# EAGLE design QuadPFets (EAGLE 7.4.0)
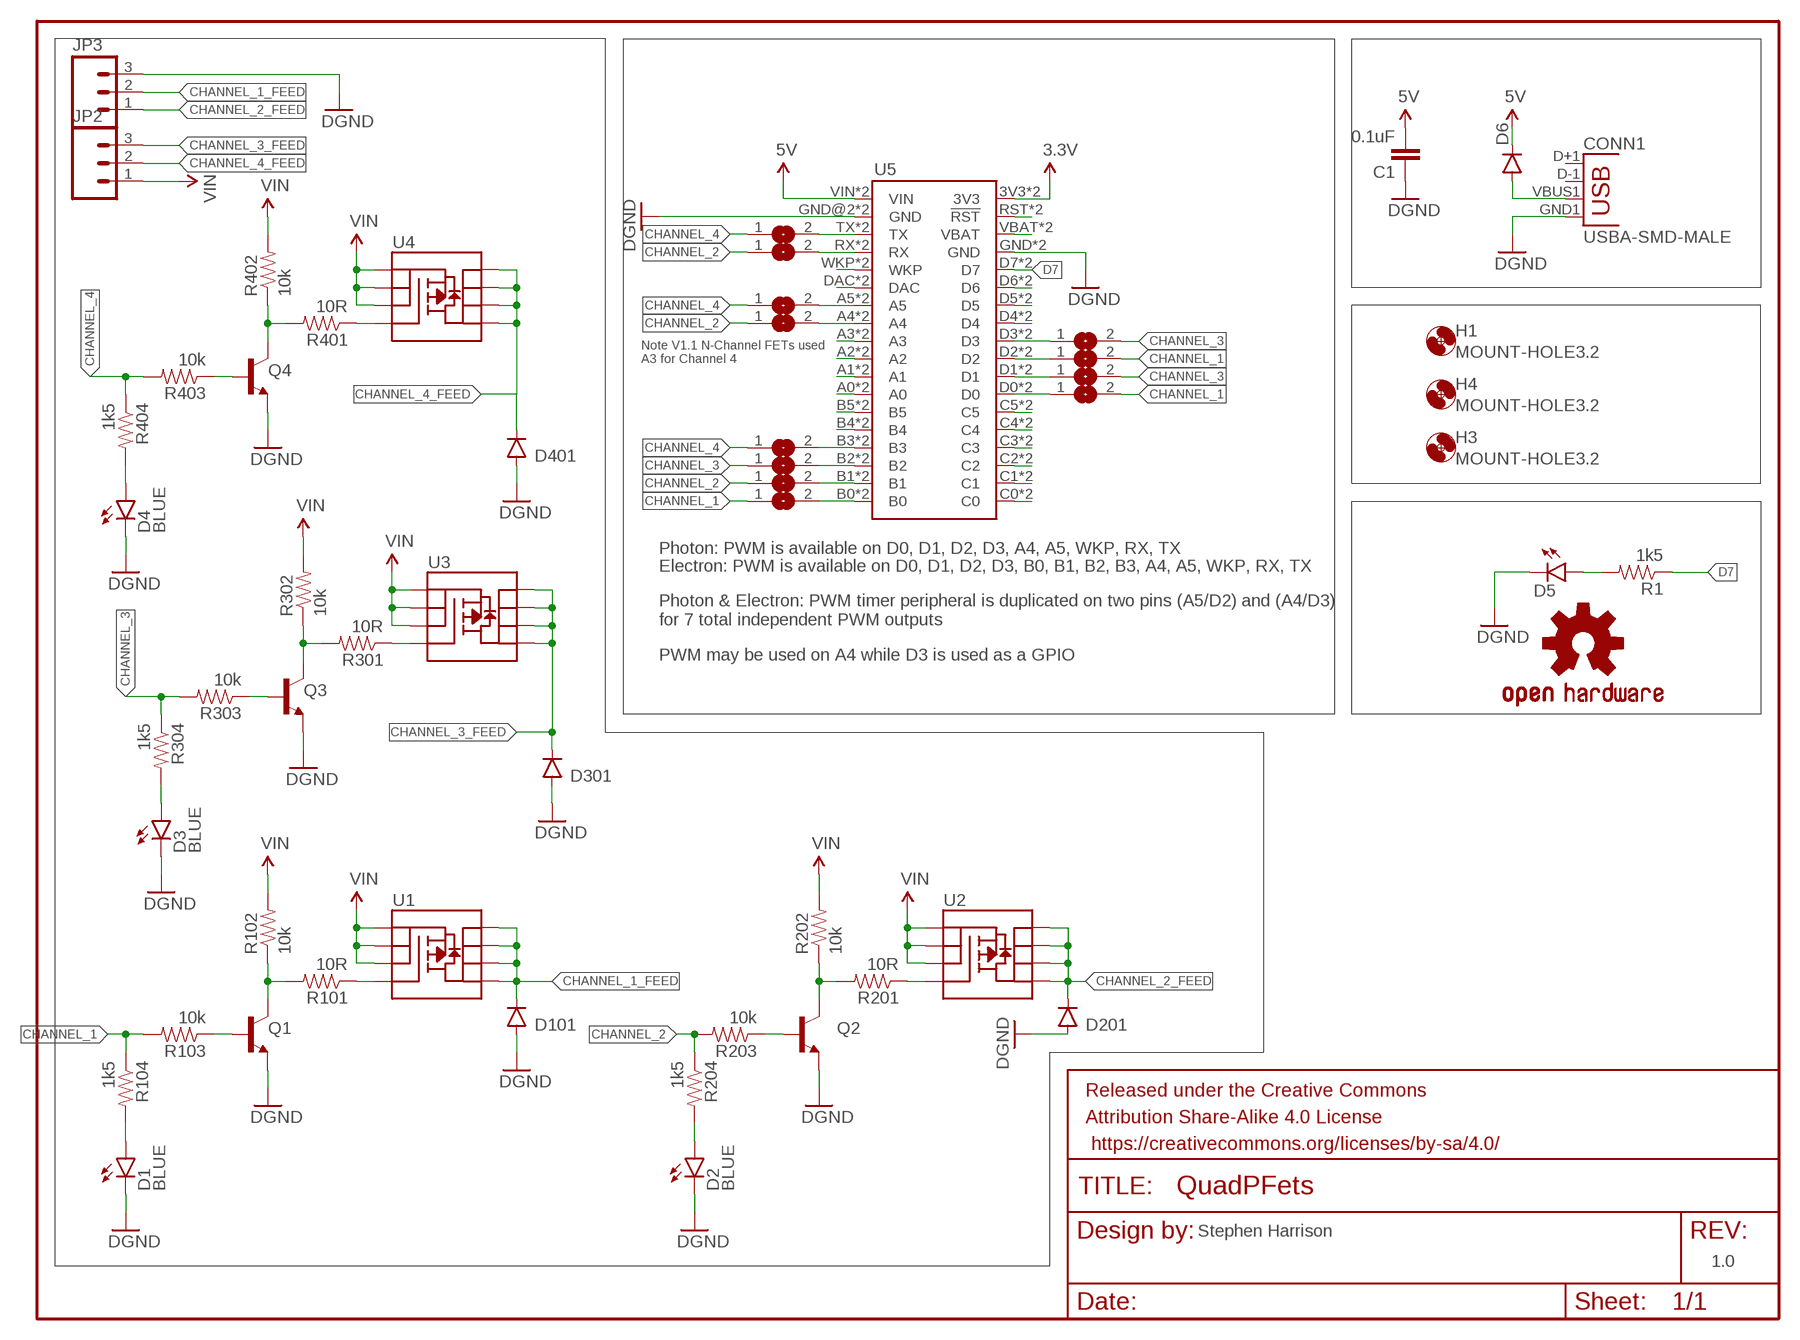
[diagram p0: schematic, sheet 1]

## Parts
C1  0.1uF  CAP0805  [0805]
CONN1  USBA-SMD-MALE  [USB-A-SMT-MALE]
D1  BLUE  LED-BLUE1206  [LED-1206]
D2  BLUE  LED-BLUE1206  [LED-1206]
D3  BLUE  LED-BLUE1206  [LED-1206]
D4  BLUE  LED-BLUE1206  [LED-1206]
D5  LED1206-BOTTOM  [LED-1206-BOTTOM]
D6  DIODESMA  [SMA-DIODE]
D101  DIODESOD123  [SOD-123]
D201  DIODESOD123  [SOD-123]
D301  DIODESOD123  [SOD-123]
D401  DIODESOD123  [SOD-123]
FRAME2  FRAME-LETTER  [CREATIVE_COMMONS]
H1  MOUNT-HOLE3.2  [3,2]
H3  MOUNT-HOLE3.2  [3,2]
H4  MOUNT-HOLE3.2  [3,2]
JP2  M03-SCREW-5MM  [SCREWTERMINAL-5MM-3]
JP3  M03-SCREW-5MM  [SCREWTERMINAL-5MM-3]
LOGO1  OSHW-LOGOM  [OSHW-LOGO-M]
Q1  BC817-40SMD  [SOT23-BEC]
Q2  BC817-40SMD  [SOT23-BEC]
Q3  BC817-40SMD  [SOT23-BEC]
Q4  BC817-40SMD  [SOT23-BEC]
R1  1k5  RESISTOR0805-RES  [0805]
R101  10R  RESISTOR0805-RES  [0805]
R102  10k  RESISTOR0805-RES  [0805]
R103  10k  RESISTOR0805-RES  [0805]
R104  1k5  RESISTOR0805-RES  [0805]
R201  10R  RESISTOR0805-RES  [0805]
R202  10k  RESISTOR0805-RES  [0805]
R203  10k  RESISTOR0805-RES  [0805]
R204  1k5  RESISTOR0805-RES  [0805]
R301  10R  RESISTOR0805-RES  [0805]
R302  10k  RESISTOR0805-RES  [0805]
R303  10k  RESISTOR0805-RES  [0805]
R304  1k5  RESISTOR0805-RES  [0805]
R401  10R  RESISTOR0805-RES  [0805]
R402  10k  RESISTOR0805-RES  [0805]
R403  10k  RESISTOR0805-RES  [0805]
R404  1k5  RESISTOR0805-RES  [0805]
SJ1  SJ  [SJ]
SJ2  SJ  [SJ]
SJ3  SJ  [SJ]
SJ4  SJ  [SJ]
SJ5  SJ  [SJ]
SJ6  SJ  [SJ]
SJ7  SJ  [SJ]
SJ8  SJ  [SJ]
SJ9  SJ  [SJ]
SJ10  SJ  [SJ]
SJ11  SJ  [SJ]
SJ12  SJ  [SJ]
U1  MOSFET-PCHANNEL-SOIC8SOIC8  [SO08]
U2  MOSFET-PCHANNEL-SOIC8SOIC8  [SO08]
U3  MOSFET-PCHANNEL-SOIC8SOIC8  [SO08]
U4  MOSFET-PCHANNEL-SOIC8SOIC8  [SO08]
U5  ELECTRONDUALNAMED  [ELECTRON_SIMPLE_SILK_NAMES_DUAL]

## Nets
3.3V: U5.3V3 U5.3V3_1(3V3)
5V: C1.2 D6.C U5.VIN U5.VIN_1B(VIN)
CHANNEL_1: R103.2 R104.1 SJ4.1 SJ5.2 SJ11.2
CHANNEL_1_FEED: D101.C JP3.2 U1.5(D) U1.6(D) U1.7(D) U1.8(D)
CHANNEL_2: R203.2 R204.1 SJ3.1 SJ8.1 SJ10.1
CHANNEL_2_FEED: D201.C JP3.1 U2.5(D) U2.6(D) U2.7(D) U2.8(D)
CHANNEL_3: R303.2 R304.1 SJ2.1 SJ6.2 SJ12.2
CHANNEL_3_FEED: D301.C JP2.3 U3.5(D) U3.6(D) U3.7(D) U3.8(D)
CHANNEL_4: R403.2 R404.1 SJ1.1 SJ7.1 SJ9.1
CHANNEL_4_FEED: D401.C JP2.2 U4.5(D) U4.6(D) U4.7(D) U4.8(D)
D7: R1.1 U5.D7 U5.D7_1(D7)
GND: C1.1 CONN1.GND1(GND) D1.C D2.C D3.C D4.C D5.C D101.A D201.A D301.A D401.A JP3.3 Q1.E Q2.E Q3.E Q4.E U5.GND U5.GND@2(GND) U5.GND_1(GND) U5.GND_1B(GND) ; supply symbol labelled DGND
N$1: CONN1.VBUS1(VBUS) D6.A
N$3: Q2.C R201.2 R202.1
N$4: Q1.C R101.2 R102.1
N$6: U5.VBAT U5.VBATT_1(VBAT)
N$7: U5.RST(!RST) U5.RST_1(!RST)
N$11: R101.1 U1.4(G)
N$12: D2.A R204.2
N$13: Q1.B R103.1
N$15: U5.D6 U5.D6_1(D6)
N$16: U5.D5 U5.D5_1(D5)
N$19: D5.A R1.2
N$20: U5.D4 U5.D4_1(D4)
N$21: D1.A R104.2
N$22: Q3.C R301.2 R302.1
N$23: U5.C5 U5.C5_1(C5)
N$24: U5.C4 U5.C4_1(C4)
N$25: U5.C3 U5.C3_1(C3)
N$26: U5.C2 U5.C2_1(C2)
N$27: R301.1 U3.4(G)
N$28: U5.C1 U5.C1_1(C1)
N$29: U5.C0 U5.C0_1(C0)
N$30: SJ8.2 U5.A4 U5.A4_1(A4)
N$31: SJ4.2 U5.B0 U5.B0_1(B0)
N$33: SJ3.2 U5.B1 U5.B1_1(B1)
N$35: SJ2.2 U5.B2 U5.B2_1(B2)
N$36: SJ1.2 U5.B3 U5.B3_1(B3)
N$37: U5.B4 U5.B4_1(B4)
N$38: U5.B5 U5.B5_1(B5)
N$39: U5.A0 U5.A0_1(A0)
N$40: U5.A1 U5.A1_1(A1)
N$41: U5.A2 U5.A2_1(A2)
N$42: U5.A3 U5.A3_1(A3)
N$43: SJ6.1 U5.D3 U5.D3_1(D3)
N$44: SJ9.2 U5.A5 U5.A5_1(A5)
N$45: U5.DAC U5.DAC_1(DAC)
N$46: U5.WKP U5.WKP_1(WKP)
N$47: SJ10.2 U5.RX U5.RX_1(RX)
N$48: SJ7.2 U5.TX U5.TX_1(TX)
N$49: SJ5.1 U5.D2 U5.D2_1(D2)
N$50: Q3.B R303.1
N$51: R201.1 U2.4(G)
N$52: D3.A R304.2
N$53: Q4.C R401.2 R402.1
N$54: R401.1 U4.4(G)
N$55: Q4.B R403.1
N$56: D4.A R404.2
N$57: Q2.B R203.1
SCL: SJ12.1 U5.D1 U5.D1_1(D1)
SDA: SJ11.1 U5.D0 U5.D0_1(D0)
VIN: JP2.1 R102.2 R202.2 R302.2 R402.2 U1.1(S) U1.2(S) U1.3(S) U2.1(S) U2.2(S) U2.3(S) U3.1(S) U3.2(S) U3.3(S) U4.1(S) U4.2(S) U4.3(S)
Unconnected: CONN1.D+1(D+) CONN1.D-1(D-)

## Notes on the sheet
- Note V1.1 N-Channel FETs used
  A3 for Channel 4
- Photon: PWM is available on D0, D1, D2, D3, A4, A5, WKP, RX, TX
- Electron: PWM is available on D0, D1, D2, D3, B0, B1, B2, B3, A4, A5, WKP, RX, TX
- Photon & Electron: PWM timer peripheral is duplicated on two pins (A5/D2) and (A4/D3) 
  for 7 total independent PWM outputs
- PWM may be used on A4 while D3 is used as a GPIO
- Stephen Harrison
- 1.0

## Library data of the parts
C1 = SparkFun-Passives:CAP: Capacitor Standard 0603 ceramic capacitor, and 0.1" leaded capacitor.
CONN1 = SparkFun-Connectors:USB: USB Connectors USB-B-PTH is fully proven SKU : PRT-00139/CONN-08278 USB-miniB is fully proven SKU : PRT-00587 USB-A-PCB is untested. USB-A-H is throughly reviewed, but untested. Spark Fun Electronics SKU : PRT-00437 USB-B-SMT is throughly reviewed, but untested. Needs silkscreen touching up. USB-A-S has not been used/tested USB-MB-H has not been used/tested USB-MICROB has been used. CONN-09505
D1-D4 = SparkFun-LED:LED-BLUE: Blue LEDs for production use Various blue LEDs stocked by SparkFun production 0603 - DIO-08575 Rebel - DIO-09553 1206 - DIO-09911; PROD_ID: DIO-09911
D5 = SparkFun-LED:LED: LEDs Standard schematic elements and footprints for 5mm, 3mm, 1206, and 0603 sized LEDs. 5mm - Spark Fun Electronics SKU : COM-00529 (and others)
D6 D101 D201 D301 D401 = SparkFun-DiscreteSemi:DIODE: Diode These are standard reverse protection diodes and small signal diodes. SMA package can handle up to about 1A. SOD-323 can handle about 200mA. What the SOD-323 package when ordering, there are some mfgs out there that are 5-pin packages.
FRAME2 = SparkFun-Aesthetics:FRAME-LETTER: Schematic Frame Standard 8.5x11 US Letter frame
H1 H3 H4 = holes:MOUNT-HOLE: MOUNTING HOLE with drill center marker
JP2 JP3 = SparkFun-Connectors:M03: Header 3 Standard 3-pin 0.1" header. Use with straight break away headers (SKU : PRT-00116), right angle break away headers (PRT-00553), swiss pins (PRT-00743), machine pins (PRT-00117), and female headers (PRT-00115). Molex polarized connector foot print use with SKU : PRT-08232 with associated crimp pins and housings.; STOREFRONT_ID: PRT-08433
LOGO1 = SparkFun-Aesthetics:OSHW-LOGO: Open Source Hardware Logo This logo indicates the piece of hardware it is found on incorporates a OSHW license and/or adheres to the definition of open source hardware found here: http://freedomdefined.org/OSHW
Q1-Q4 = transistor-npn:BC817*: NPN Transistor
R1 R101-R104 R201-R204 R301-R304 R401-R404 = SparkFun-Resistors:RESISTOR: Resistor Basic schematic elements and footprints for 0603, 1206, and PTH resistors.
SJ1-SJ12 = jumper:SJ: SMD solder JUMPER
U1-U4 = SparkFun-DiscreteSemi:MOSFET-PCHANNEL-SOIC8: Generic 8-pin PMOSFET
U5 = Tinamous:ELECTRON

## Board
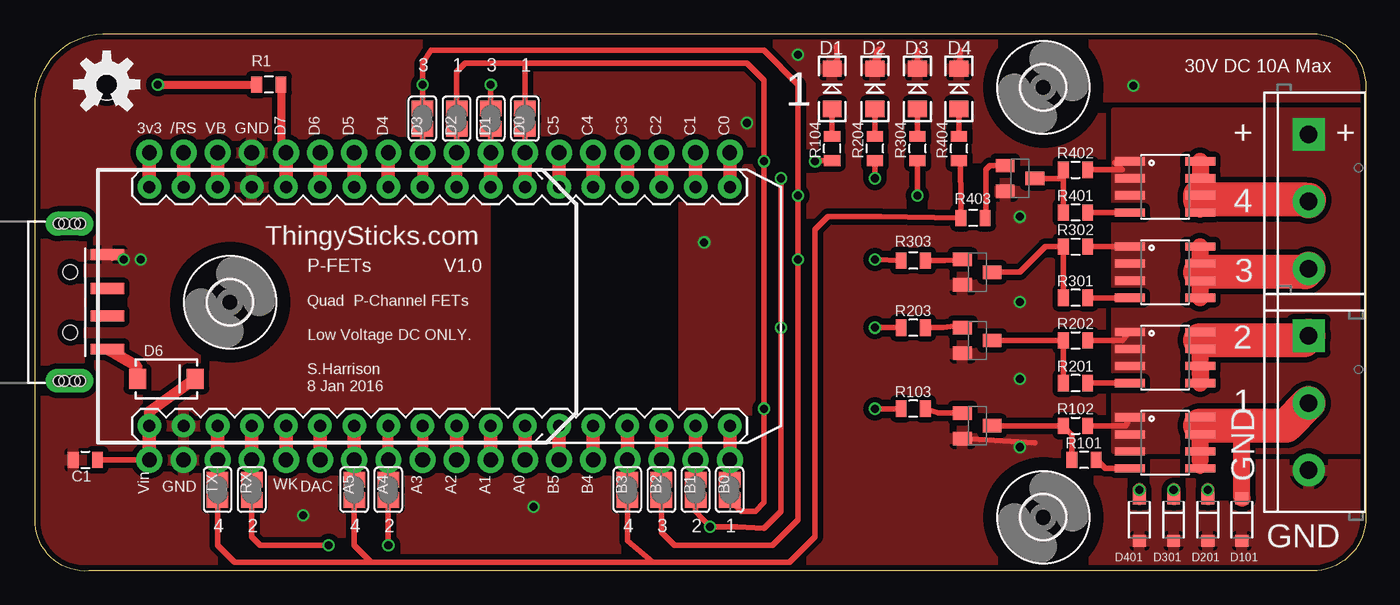
[diagram p1: board, top side]
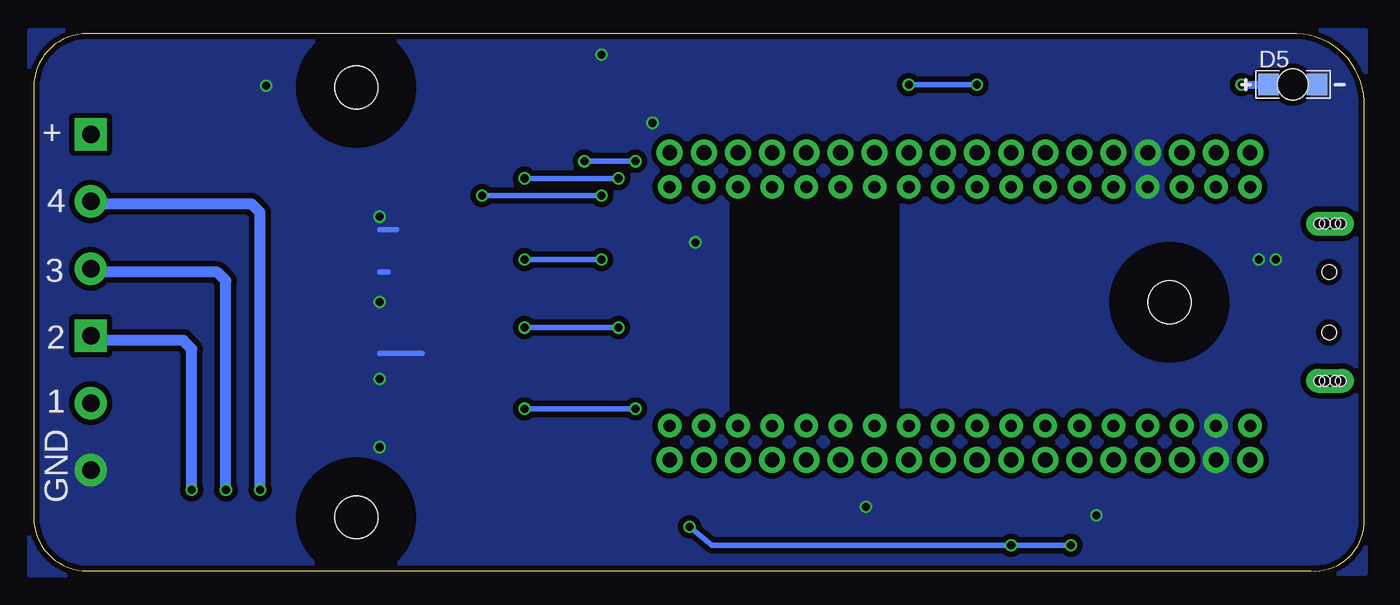
[diagram p2: board, bottom side, seen from below]

Size 99 x 40.01 mm. Coordinates in mm from the lower left corner, seen from the top.
Outline: 5.5,40.01 95,40.01 arc-90 99,36.01 99,4.01 arc-90 95,0.01 4,0.01 arc-90 0,3.51 0,35.01 arc-90 5.5,40.01
Copper layers (1*16): Top 0.035mm / dielectric 1.5mm / Bottom 0.035mm
Design rules "dirt_cheap_dirty_boards.v1": minimum track width 5mil, minimum drill 12mil, track to track 5mil, track to pad 5mil, pad to pad 5mil, via to via 5mil, smd to smd 0mil, copper to edge 10mil, drill to drill 10mil, minimum pad ring 10mil, minimum via ring 6mil, stop-mask expansion 2mil, vias tented up to drill 25mil, thermal gap 10mil
tRestrict: area 34.5,9.5 to 47.2,29.9
bRestrict: area 35.2,9.5 to 46.6,29.9

### Footprints (pad centres in the part's own frame; a part is rotated, then mirrored left to right if it is on the bottom)
0805 = smd 0.8 x 1.2: 1 -0.9,0; 2 0.9,0
USB-A-SMT-MALE = smd 0.8 x 2.5: D+1 1.027,-5.87; D-1 -1.027,-5.87; GND1 3.551,-5.87; VBUS1 -3.5,-5.87 | drill 0.8 pad 1.778 long: P$1 5.85,-3.05; P$3 -5.85,-3.05 | hole 1.1: 2.25,-3.12; -2.25,-3.12 | hole 0.8: -5.85,-3.45; -5.85,-3.85; -5.85,-2.65; -5.85,-2.25; 5.85,-3.45; 5.85,-3.85; 5.85,-2.65; 5.85,-2.25
LED-1206 = smd 1.2 x 1.4: A -1.5,0; C 1.5,0
LED-1206-BOTTOM = smd 1.5 x 1.6: A -1.8,0; C 1.8,0 | hole 2.3: 0,0
SMA-DIODE = smd 1.27 x 1.47: A -2.15,0; C 2.15,0
SOD-123 = smd 0.9 x 0.95: A 1.575,0; C -1.575,0
3,2 = hole 3.2: 0,0
SCREWTERMINAL-5MM-3 = drill 1.3 pad 2.413 square: 1 0,0 | drill 1.3 pad 2.413: 2 5,0; 3 10,0
SOT23-BEC = smd 1 x 1.4: B -0.95,-1.1; C 0,1.1; E 0.95,-1.1
SJ = smd 1.168 x 1.6: 1 -0.762,0; 2 0.762,0
SO08 = smd 0.61 x 2.21: 1 -1.905,-2.616; 2 -0.635,-2.616; 3 0.635,-2.616; 4 1.905,-2.616; 5 1.905,2.616; 6 0.635,2.616; 7 -0.635,2.616; 8 -1.905,2.616
ELECTRON_SIMPLE_SILK_NAMES_DUAL = drill 0.889 pad 1.753: 3V3 1.27,22.86; A0 29.21,5.08; A1 26.67,5.08; A2 24.13,5.08; A3 21.59,5.08; A4 19.05,5.08; A5 16.51,5.08; B0 44.45,5.08; B1 41.91,5.08; B2 39.37,5.08; B3 36.83,5.08; B4 34.29,5.08; B5 31.75,5.08; C0 44.45,22.86; C1 41.91,22.86; C2 39.37,22.86; C3 36.83,22.86; C4 34.29,22.86; C5 31.75,22.86; D0 29.21,22.86; D1 26.67,22.86; D2 24.13,22.86; D3 21.59,22.86; D4 19.05,22.86; D5 16.51,22.86; D6 13.97,22.86; D7 11.43,22.86; DAC 13.97,5.08; GND 8.89,22.86; GND@2 3.81,5.08; RST 3.81,22.86; RX 8.89,5.08; TX 6.35,5.08; VBAT 6.35,22.86; VIN 1.27,5.08; WKP 11.43,5.08 | drill 1.1 pad 1.93: 3V3_1 1.27,25.4; A0_1 29.21,2.54; A1_1 26.67,2.54; A2_1 24.13,2.54; A3_1 21.59,2.54; A4_1 19.05,2.54; A5_1 16.51,2.54; B0_1 44.45,2.54; B1_1 41.91,2.54; B2_1 39.37,2.54; B3_1 36.83,2.54; B4_1 34.29,2.54; B5_1 31.75,2.54; C0_1 44.45,25.4; C1_1 41.91,25.4; C2_1 39.37,25.4; C3_1 36.83,25.4; C4_1 34.29,25.4; C5_1 31.75,25.4; D0_1 29.21,25.4; D1_1 26.67,25.4; D2_1 24.13,25.4; D3_1 21.59,25.4; D4_1 19.05,25.4; D5_1 16.51,25.4; D6_1 13.97,25.4; D7_1 11.43,25.4; DAC_1 13.97,2.54; GND_1 8.89,25.4; GND_1B 3.81,2.54; RST_1 3.81,25.4; RX_1 8.89,2.54; TX_1 6.35,2.54; VBATT_1 6.35,25.4; VIN_1B 1.27,2.54; WKP_1 11.43,2.54

### Placement (x,y rotation side)
C1  3.73,8.28 0 top
CONN1  -0.5,20.01 90 top
D1  59.3,35.9 90 top
D2  62.47,35.9 90 top
D3  65.64,35.9 90 top
D4  68.73,35.9 90 top
D5  5.32,36.22 0 bottom
D6  9.77,14.31 0 top
D101  89.78,3.83 270 top
D201  87.23,3.83 270 top
D301  84.69,3.83 270 top
D401  82.16,3.83 270 top
FRAME2  -1.66,-8.23 0 top  (outside the outline)
H1  14.5,20.01 0 top
H3  75,4.01 0 top
H4  75,36.01 0 top
JP2  94.75,32.51 270 top
JP3  94.75,17.51 270 top
LOGO1  5.32,36.22 0 top
Q1  70.09,10.82 270 top
Q2  70.09,17.17 270 top
Q3  70.09,22.25 270 top
Q4  73.27,29.23 270 top
R1  17.38,36.22 180 top
R101  78.03,8.28 180 top
R102  77.39,10.82 0 top
R103  65.33,12.09 180 top
R104  59.3,31.45 90 top
R201  77.39,13.99 180 top
R202  77.39,17.17 0 top
R203  65.33,18.12 180 top
R204  62.47,31.45 90 top
R301  77.39,20.34 180 top
R302  77.39,24.15 0 top
R303  65.33,23.11 180 top
R304  65.64,31.45 90 top
R401  77.39,26.69 180 top
R402  77.39,29.87 0 top
R403  69.77,26.29 180 top
R404  68.73,31.45 90 top
SJ1  44.05,6.05 90 top
SJ2  46.59,6.05 90 top
SJ3  49.14,6.05 90 top
SJ4  51.67,6.05 90 top
SJ5  31.35,33.68 90 top
SJ6  28.81,33.68 90 top
SJ7  13.57,6.05 90 top
SJ8  26.27,6.05 90 top
SJ9  23.73,6.05 90 top
SJ10  16.11,6.05 90 top
SJ11  36.44,33.68 90 top
SJ12  33.9,33.68 90 top
U1  84.06,9.55 270 top
U2  84.06,15.9 270 top
U3  84.06,22.25 270 top
U4  84.06,28.6 270 top
U5  7.23,5.74 0 top

### Tracks (layer width: path | path; a pad name or v marks a point on that pad's centre or on a via)
3.3V
  Top 1.016: U5.3V3 U5.3V3_1
5V
  Top 0.406: C1.2 U5.VIN_1B
  Top 0.813: U5.VIN 8.5,11.84 D6.C
  Top 1.016: U5.VIN_1B U5.VIN
CHANNEL_1  (via drill 0.6)
  Top 0.406: 36.44,37.8 52.94,37.8 54.22,36.53 v54.22,30.5 v54.22,12.09 54.22,5.1 53.58,4.47 52.5,4.47 SJ4.1 | 36.44,37.8 31.99,37.8 31.35,37.17 SJ5.2 | R103.2 v62.47,12.09 | R104.1 58.03,30.55 v58.03,30.5 | SJ11.2 36.44,37.8
  Bottom 0.406: v62.47,12.09 v54.22,12.09 | v58.03,30.5 v54.22,30.5
CHANNEL_1_FEED
  Top 0.813: U1.5 86.68,8.28 | U1.7 86.68,10.82 U1.8
  Top 1.016: D101.C 89.78,5.42
  Top 1.27: 86.68,8.28 U1.6 U1.7 | 89.78,5.42 89.78,10.82
  Top 2.54: JP3.2 93.06,10.82 89.78,10.82 86.68,10.82
CHANNEL_2  (via drill 0.6)
  Top 0.406: SJ3.1 49.14,4.47 v50.2,3.29 52.22,3.29 54.22,3.2 55.48,4.47 v55.48,18.12 v55.48,29.23 | SJ8.1 v26.27,1.93 | v62.47,18.12 R203.2 | R204.1 v62.47,29.23 | SJ10.1 16.11,2.56 16.75,1.93 v21.83,1.93
  Bottom 0.406: v50.2,3.29 48.52,1.93 v26.27,1.93 v21.83,1.93 | v55.48,18.12 v62.47,18.12 | v62.47,29.23 v55.48,29.23
CHANNEL_2_FEED  (via drill 0.6)
  Top 0.61: U2.8 86.68,17.17 U2.7
  Top 0.813: 86.68,14.7 86.6,14.63 86.68,14.55 U2.6
  Top 1.016: D201.C v87.23,6.05
  Top 1.27: 86.68,14.7 U2.7 | U2.6 U2.5
  Top 2.54: JP3.1 94.41,17.17 86.68,17.17
  Bottom 0.813: v87.23,6.05 87.23,16.53 87.87,17.17 94.41,17.17 JP3.1
CHANNEL_3  (via drill 0.6)
  Top 0.406: SJ2.1 46.59,2.88 47.55,1.93 54.85,1.93 56.75,3.83 v56.75,23.2 v56.75,27.96 56.75,36.22 54.22,38.76 29.45,38.76 28.81,37.8 v28.81,36.22 28.81,34.95 SJ6.2 | v62.47,23.2 R303.2 | R304.1 v65.64,27.96 | SJ12.2 v33.9,36.22
  Bottom 0.406: v56.75,23.2 v62.47,23.2 | v65.64,27.96 v56.75,27.96 | v33.9,36.22 v28.81,36.22
CHANNEL_3_FEED  (via drill 0.6)
  Top 0.813: U3.6 86.68,22.25 U3.7
  Top 1.016: D301.C v84.69,6.05
  Top 1.27: U3.5 U3.6 | U3.7 U3.8
  Top 2.54: JP2.3 94.49,22.25 86.68,22.25
  Bottom 0.813: v84.69,6.05 84.69,21.61 85.33,22.25 94.49,22.25 JP2.3
CHANNEL_4
  Top 0.406: 45.96,0.66 56.12,0.66 58.03,2.56 58.03,25.42 58.98,26.37 62.94,26.37 R403.2 68.87,28.65 68.82,29.23 68.82,30.47 R404.1 | 25.01,0.66 45.96,0.66 | 45.96,0.66 44.05,2.24 SJ1.1 | 25.01,0.66 23.73,1.93 SJ9.1 | SJ7.1 13.57,1.93 14.84,0.66 25.01,0.66
CHANNEL_4_FEED  (via drill 0.6)
  Top 0.813: U4.5 U4.6 U4.7
  Top 1.016: D401.C v82.16,6.05
  Top 1.27: U4.8 U4.7
  Top 2.54: 94.78,27.64 JP2.2 94.61,27.64 86.68,27.64 U4.6
  Bottom 0.813: v82.16,6.05 82.16,26.69 82.79,27.33 94.57,27.33 JP2.2
D7
  Top 0.61: R1.1 18.28,31.51 U5.D7_1
  Top 1.016: U5.D7 U5.D7_1
GND  (via drill 0.6)
  Top 0.406: D1.C 59.7,38.12 59.61,39.08 | Q1.E 74.39,9.55 | D3.C 65.64,38.76 | D4.C 68.82,38.76
  Top 0.61: D2.C 62.79,38.76
  Top 0.813: 5.73,23.52 CONN1.GND1
  Bottom 0.406: 73.27,16.21 70.09,16.21 | 73.27,22.25 72.63,22.25 | 73.27,25.42 72,25.42
  other vias: 6.59,23.2 7.86,23.2 49.77,24.47 81.7,36.13 73.27,20.02 73.27,26.37 73.27,14.31 73.27,9.23 37.07,4.78 52.94,33.36 19.92,4.15 56.75,38.44
  pour Bottom (isolate 0.406, rank 6, no thermals): -0.08,40.22 99.3,40.22 99.3,-0.3 -0.08,-0.17
  pour Top (isolate 0.406, rank 6): -0.08,39.71 99.62,40.03 99.62,-0.3 -0.08,-0.3
N$1
  Top 0.813: CONN1.VBUS1 5.95,16.21 7.54,15.26 D6.A
N$3
  Top 0.406: R201.2 R202.1 Q2.C
N$4
  Top 0.406: R101.2 77.13,10.13 77.08,10.18 R102.1 Q1.C
N$6
  Top 1.016: U5.VBAT U5.VBATT_1
N$7
  Top 1.016: U5.RST U5.RST_1
N$11
  Top 0.406: R101.1 78.98,8.28 79.61,7.64 U1.4
N$12
  Top 0.406: D2.A R204.2
N$13
  Top 0.406: R103.1 67.18,11.77 Q1.B
N$15
  Top 1.016: U5.D6 U5.D6_1
N$16
  Top 1.016: U5.D5 U5.D5_1
N$19  (via drill 0.6)
  Top 0.61: v9.13,36.22 R1.2
  Bottom 0.61: v9.13,36.22 D5.A
N$20
  Top 1.016: U5.D4 U5.D4_1
N$21
  Top 0.406: R104.2 D1.A
N$22
  Top 0.406: R301.2 R302.1 75.17,24.15 73.27,22.25 Q3.C
N$23
  Top 1.016: U5.C5_1 U5.C5
N$24
  Top 1.016: U5.C4_1 U5.C4
N$25
  Top 1.016: U5.C3_1 U5.C3
N$26
  Top 1.016: U5.C2_1 U5.C2
N$27
  Top 0.406: U3.4 R301.1
N$28
  Top 1.016: U5.C1_1 U5.C1
N$29
  Top 1.016: U5.C0_1 U5.C0
N$30
  Top 0.406: SJ8.2 U5.A4_1
  Top 0.813: U5.A4_1 U5.A4
N$31
  Top 0.406: SJ4.2 U5.B0_1
  Top 1.016: U5.B0_1 U5.B0
N$33
  Top 0.406: SJ3.2 U5.B1_1
  Top 1.016: U5.B1 U5.B1_1
N$35
  Top 0.406: SJ2.2 U5.B2_1
  Top 1.016: U5.B2_1 U5.B2
N$36
  Top 0.406: SJ1.2 U5.B3_1
  Top 1.016: U5.B3 U5.B3_1
N$37
  Top 1.016: U5.B4_1 U5.B4
N$38
  Top 1.016: U5.B5 U5.B5_1
N$39
  Top 1.016: U5.A0_1 U5.A0
N$40
  Top 1.016: U5.A1 U5.A1_1
N$41
  Top 1.016: U5.A2_1 U5.A2
N$42
  Top 0.813: U5.A3 U5.A3_1
N$43
  Top 0.406: SJ6.1 U5.D3_1
  Top 0.813: U5.D3_1 U5.D3
N$44
  Top 0.813: SJ9.2 U5.A5_1
  Top 1.016: U5.A5 U5.A5_1
N$45
  Top 1.016: U5.DAC_1 U5.DAC
N$46
  Top 1.016: U5.WKP U5.WKP_1
N$47
  Top 0.406: SJ10.2 U5.RX_1
  Top 1.016: U5.RX_1 U5.RX
N$48
  Top 0.406: SJ7.2 U5.TX_1
  Top 1.016: U5.TX U5.TX_1
N$49
  Top 0.406: SJ5.1 U5.D2_1
  Top 0.813: U5.D2_1 U5.D2
N$50
  Top 0.406: R303.1 67.64,23.11 Q3.B
N$51
  Top 0.406: U2.4 R201.1
N$52
  Top 0.406: R304.2 D3.A
N$53
  Top 0.406: R401.2 R402.1 76.49,29.28 76.44,29.23 Q4.C
N$54
  Top 0.406: R401.1 U4.4
N$55
  Top 0.406: Q4.B 71.04,30.18 70.72,29.87 70.72,26.34 R403.1
N$56
  Top 0.406: D4.A R404.2
N$57
  Top 0.406: Q2.B 68.67,18.27 67.55,18.12 R203.1
SCL
  Top 0.406: SJ12.1 U5.D1_1
  Top 1.016: U5.D1 U5.D1_1
SDA
  Top 0.406: SJ11.1 U5.D0_1
  Top 1.016: U5.D0_1 U5.D0
VIN
  Top 0.406: R302.2 U3.1 | R202.2 80.89,17.17 U2.1 | R102.2 81.15,10.82 U1.1 | R402.2 80.89,29.87 80.34,30.41 80.7,30.41 U4.1
  pour Top (isolate 0.406, no thermals): 98.67,34.31 98.67,8.91 80.25,8.91 80.25,34.31

### Text on the board
tNames: 30V DC 10A Max | 3 | 1 | 3 | 1 | 1 | + | + | 4 | ThingySticks.com | P-FETs | V1.0 | 3 | Quad P-Channel FETs | Low Voltage DC ONLY. | 2 | S.Harrison | 8 Jan 2016 | 1 | GND | GND | 4 | 2 | 4 | 2 | 4 | 3 | 2 | 1
bNames: + | 4 | 3 | 2 | 1 | GND